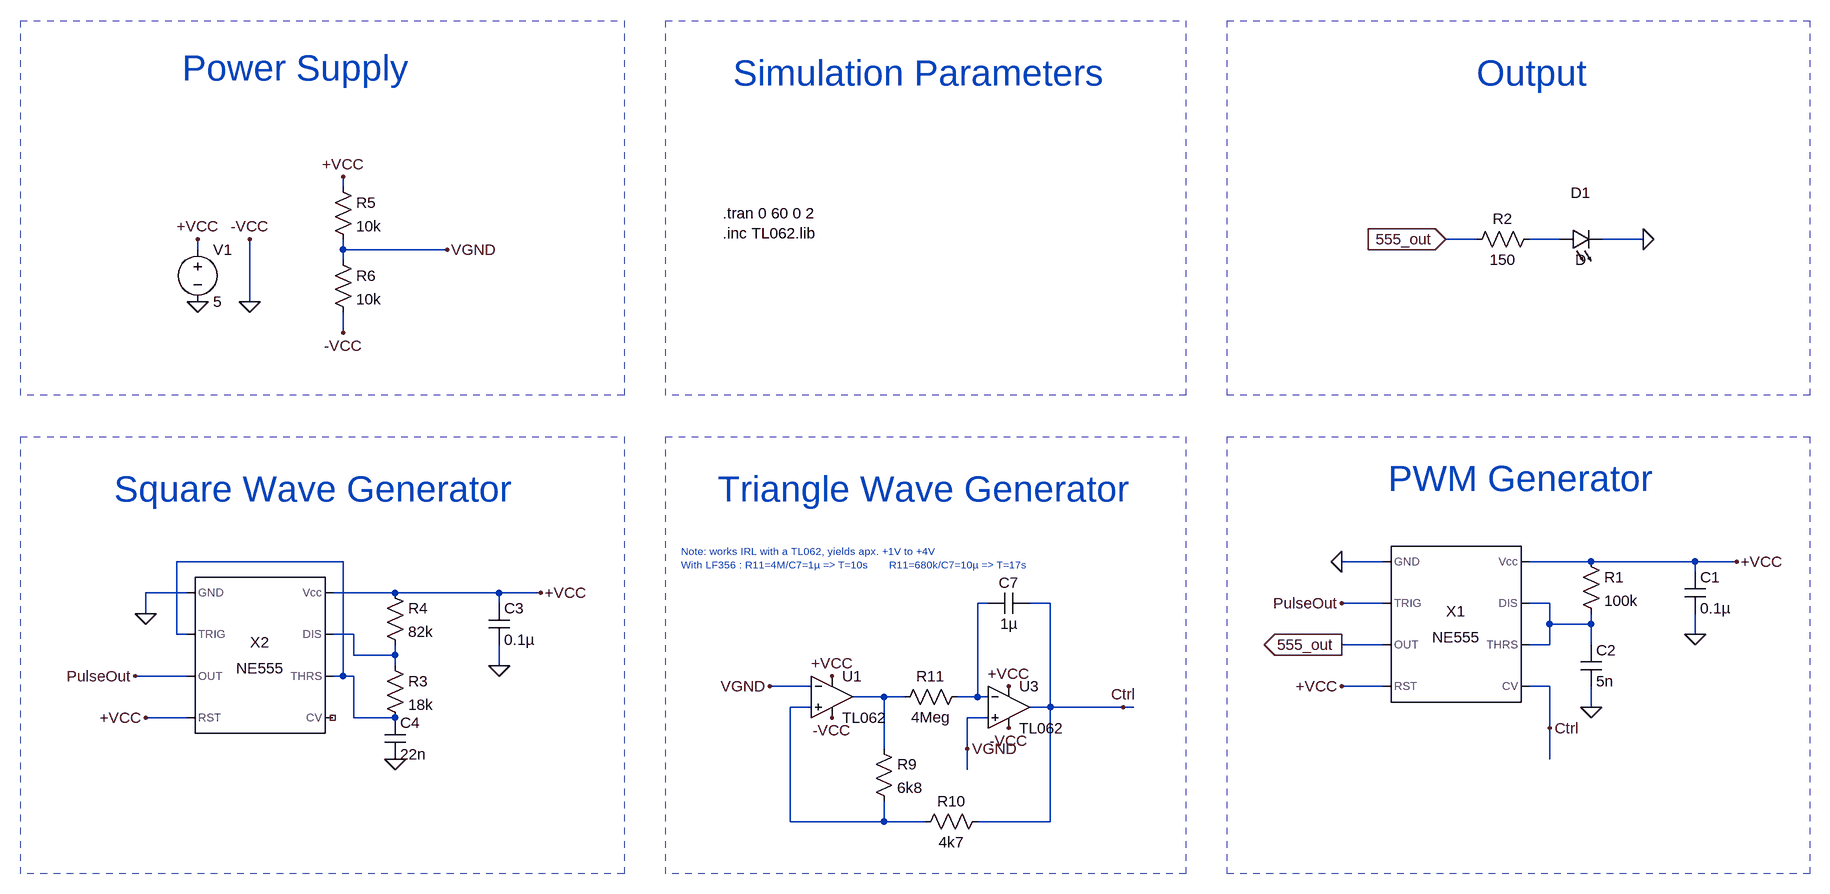
[diagram p0: schematic croissant.asc]
croissant.asc, the LTspice schematic file:
Version 4
SHEET 1 2372 1364
WIRE -16 -96 -16 -112
WIRE 1728 -16 1680 -16
WIRE 1856 -16 1808 -16
WIRE 1984 -16 1920 -16
WIRE -240 0 -240 -16
WIRE -16 0 -16 -16
WIRE 144 0 -16 0
WIRE -16 16 -16 0
WIRE -160 80 -160 -16
WIRE -16 128 -16 96
WIRE -16 480 -272 480
WIRE 1584 480 1520 480
WIRE 1904 480 1808 480
WIRE 2064 480 1904 480
WIRE 2128 480 2064 480
WIRE 2064 496 2064 480
WIRE -256 528 -320 528
WIRE 64 528 -32 528
WIRE 224 528 64 528
WIRE 288 528 224 528
WIRE 224 544 224 528
WIRE 976 544 960 544
WIRE 1072 544 1040 544
WIRE 1584 544 1520 544
WIRE 1840 544 1808 544
WIRE -320 560 -320 528
WIRE 1840 576 1840 544
WIRE 1904 576 1904 560
WIRE 1904 576 1840 576
WIRE -272 592 -272 480
WIRE -256 592 -272 592
WIRE 0 592 -32 592
WIRE 2064 592 2064 560
WIRE 1584 608 1520 608
WIRE 1840 608 1840 576
WIRE 1840 608 1808 608
WIRE 1904 608 1904 576
WIRE 0 624 0 592
WIRE 64 624 64 608
WIRE 64 624 0 624
WIRE 64 640 64 624
WIRE 224 640 224 608
WIRE -256 656 -336 656
WIRE -16 656 -16 480
WIRE -16 656 -32 656
WIRE 0 656 -16 656
WIRE 704 672 640 672
WIRE 1584 672 1520 672
WIRE 1840 672 1808 672
WIRE 816 688 768 688
WIRE 848 688 816 688
WIRE 960 688 960 544
WIRE 960 688 928 688
WIRE 976 688 960 688
WIRE 704 704 672 704
WIRE 1072 704 1072 544
WIRE 1072 704 1040 704
WIRE 1184 704 1072 704
WIRE 1200 704 1184 704
WIRE 1904 704 1904 672
WIRE -256 720 -320 720
WIRE 0 720 0 656
WIRE 64 720 0 720
WIRE 976 720 944 720
WIRE 1840 736 1840 672
WIRE 816 768 816 688
WIRE 944 768 944 720
WIRE 1840 784 1840 736
WIRE 944 800 944 768
WIRE 672 880 672 704
WIRE 816 880 816 848
WIRE 816 880 672 880
WIRE 880 880 816 880
WIRE 1072 880 1072 704
WIRE 1072 880 960 880
FLAG 1520 480 0
FLAG 2128 480 +VCC
FLAG 2064 592 0
FLAG 1904 704 0
FLAG 1520 672 +VCC
FLAG 1520 608 555_out
IOPIN 1520 608 Out
FLAG -240 80 0
FLAG -240 -16 +VCC
FLAG 1840 736 Ctrl
FLAG 1680 -16 555_out
IOPIN 1680 -16 In
FLAG 1984 -16 0
FLAG -320 560 0
FLAG 288 528 +VCC
FLAG 224 640 0
FLAG -320 720 +VCC
FLAG 64 784 0
FLAG -336 656 PulseOut
FLAG 1520 544 PulseOut
FLAG -160 80 0
FLAG -160 -16 -VCC
FLAG 736 656 +VCC
FLAG 1008 672 +VCC
FLAG 736 720 -VCC
FLAG 1008 736 -VCC
FLAG 1184 704 Ctrl
FLAG -16 -112 +VCC
FLAG -16 128 -VCC
FLAG 144 0 VGND
FLAG 640 672 VGND
FLAG 944 768 VGND
SYMBOL cap 2048 496 R0
SYMATTR InstName C1
SYMATTR Value 0.1µ
SYMBOL res 1888 464 R0
SYMATTR InstName R1
SYMATTR Value 100k
SYMBOL cap 1888 608 R0
SYMATTR InstName C2
SYMATTR Value 5n
SYMBOL voltage -240 -16 R0
WINDOW 123 0 0 Left 0
WINDOW 39 0 0 Left 0
SYMATTR InstName V1
SYMATTR Value 5
SYMBOL ne555 1696 576 R0
SYMATTR InstName X1
SYMBOL res 1824 -32 R90
WINDOW 0 0 56 VBottom 2
WINDOW 3 32 56 VTop 2
SYMATTR InstName R2
SYMATTR Value 150
SYMBOL LED 1856 0 R270
WINDOW 0 72 32 VTop 2
WINDOW 3 0 32 VBottom 2
SYMATTR InstName D1
SYMBOL cap 208 544 R0
SYMATTR InstName C3
SYMATTR Value 0.1µ
SYMBOL ne555 -144 624 R0
SYMATTR InstName X2
SYMBOL cap 48 720 R0
SYMATTR InstName C4
SYMATTR Value 22n
SYMBOL res 48 624 R0
SYMATTR InstName R3
SYMATTR Value 18k
SYMBOL res 48 512 R0
SYMATTR InstName R4
SYMATTR Value 82k
SYMBOL res 800 752 R0
SYMATTR InstName R9
SYMATTR Value 6k8
SYMBOL res 976 864 R90
WINDOW 0 0 56 VBottom 2
WINDOW 3 32 56 VTop 2
SYMATTR InstName R10
SYMATTR Value 4k7
SYMBOL res 944 672 R90
WINDOW 0 0 56 VBottom 2
WINDOW 3 32 56 VTop 2
SYMATTR InstName R11
SYMATTR Value 4Meg
SYMBOL cap 1040 528 R90
WINDOW 0 0 32 VBottom 2
WINDOW 3 32 32 VTop 2
SYMATTR InstName C7
SYMATTR Value 1µ
SYMBOL res -32 -112 R0
SYMATTR InstName R5
SYMATTR Value 10k
SYMBOL res -32 0 R0
SYMATTR InstName R6
SYMATTR Value 10k
SYMBOL OpAmps\\opamp2 736 624 R0
SYMATTR InstName U1
SYMATTR Value TL062
SYMBOL OpAmps\\opamp2 1008 640 R0
SYMATTR InstName U3
SYMATTR Value TL062
TEXT 568 -56 Left 2 !.tran 0 60 0 2\n.inc TL062.lib
TEXT -368 368 Left 5 ;Square Wave Generator
TEXT 560 368 Left 5 ;Triangle Wave Generator
TEXT 1592 352 Left 5 ;PWM Generator
TEXT -264 -280 Left 5 ;Power Supply
TEXT 584 -272 Left 5 ;Simulation Parameters
TEXT 1728 -272 Left 5 ;Output
TEXT 504 464 Left 1 ;Note: works IRL with a TL062, yields apx. +1V to +4V\nWith LF356 : R11=4M/C7=1µ => T=10s       R11=680k/C7=10µ => T=17s
RECTANGLE Normal 1280 960 480 288 2
RECTANGLE Normal 416 224 -512 -352 2
RECTANGLE Normal 1280 224 480 -352 2
RECTANGLE Normal 2240 224 1344 -352 2
RECTANGLE Normal 416 960 -512 288 2
RECTANGLE Normal 2240 960 1344 288 2

The netlist it stands for:
* croissant.asc
C1 +VCC 0 0.1µ
R1 +VCC N004 100k
C2 N004 0 5n
V1 +VCC 0 5
XX1 0 PulseOut 555_out +VCC Ctrl N004 N004 +VCC NE555  ; pins GND TRIG OUT RST CV THRS DIS Vcc
R2 N001 555_out 150
D1 N001 0 D
C3 +VCC 0 0.1µ
XX2 0 N002 PulseOut +VCC NC_01 N002 N005 +VCC NE555  ; pins GND TRIG OUT RST CV THRS DIS Vcc
C4 N002 0 22n
R3 N005 N002 18k
R4 +VCC N005 82k
R9 N006 N007 6k8
R10 Ctrl N007 4k7
R11 N003 N006 4Meg
C7 Ctrl N003 1µ
R5 +VCC VGND 10k
R6 VGND 0 10k
XU1 N007 VGND +VCC 0 N006 TL062  ; pins In+ In- V+ V- OUT
XU3 VGND N003 +VCC 0 Ctrl TL062  ; pins In+ In- V+ V- OUT
.model D D
.lib standard.dio
.tran 0 60 0 2
.inc TL062.lib
* Square Wave Generator
* Triangle Wave Generator
* PWM Generator
* Power Supply
* Simulation Parameters
* Output
* Note: works IRL with a TL062, yields apx. +1V to +4V
* With LF356 : R11=4M/C7=1µ => T=10s       R11=680k/C7=10µ => T=17s
.lib NE555.sub
.backanno
.end